# EAGLE design BIG deported Antenna (EAGLE 7.3.0)
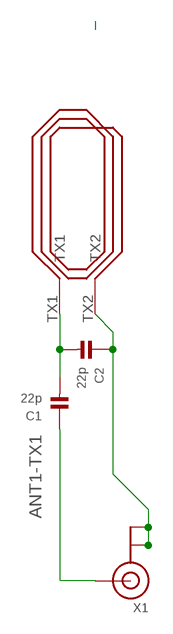
[diagram p0: schematic, sheet 1]

## Parts
C1  22p  CAP_CERAMIC0603  [0603]
C2  22p  CAP_CERAMIC0603  [0603]
U$1  KEYDUINO_DEPORTED_ANTENNA  [KEYDUINO_DEPORTED_ANTENNA]
X1  ANTENNA_U.FL  [U.FL]

## Nets
ANT1-TX1: C1.1 X1.3(SIGNAL)
N$1: C2.1 U$1.TX2 X1.1(GND) X1.2(GND)
TX2_ANTENNA: C1.2 C2.2 U$1.TX1

## Library data of the parts
C1 C2 = microbuilder:CAP_CERAMIC: Ceramic Capacitors 0402 - 0402 Surface Mount Capacitors 16pF 50V 5% [Digikey: 445-4899-2-ND] 18pF 50V 5% [Digikey: 490-1281-2-ND] 22pF 50V 5% [Digikey: 490-1283-2-ND] 68pF 50V 5% [Digikey: 490-1289-2-ND] 0.1uF 10V 10% [Digikey: 490-1318-2-ND] 0603 - 0603 Surface Mount Capacitors 16 pF 50V 5% [Digikey: 445-5051-2-ND] 22 pF 50V [Digikey: PCC220ACVTR-ND] 33 pF 50V 5% [Digikey: 490-1415-1-ND] 56pF 50V 5% [Digikey: 490-1421-1-ND] 220pF 50V 5% [Digikey: 445-1285-1-ND] 680 pF 50V 2200 pF 50V 5% C0G [Digikey: 445-1297-1-ND] 5600 pF 100V 5% X7R [Digikey: 478-3711-1-ND] 0.1 µF 25V 10% [Digikey: PCC2277TR-ND] 0.22 µF 16V 10% X7R [Digikey: 445-1318-1-ND] 1.0 µF 25V 10% [Digikey: 445-5146-2-ND] 0603 - RF Specific 3pF 250V +/-0.1pF RF [Digikey: 712-1347-1-ND] 18 pF 250V 5% [Digikey: 478-3505-1-ND or 712-1322-1-ND] 56 pF 250V 5% C0G RF [Digikey: 490-4867-1-ND] 68 pF 250V RF [Digikey: 490-4868-1-ND] 0805 - 0805 Surface Mount Capacitors 220 pF 250V 2% RF Ceramic Capacitor [Digikey: 712-1398-1-ND] 1000 pF 50V 2% NP0 Ceramic Capacitor [Digikey: 478-3760-1-ND] 0.1 µF 25V 10% Ceramic Capacitor [Digikey: PCC1828TR-ND] 1.0 µF 16V 10% Ceramic Capacitor[Digikey: 490-1691-2-ND] 10.0 µF 10V 10% Ceramic Capacitor[Digikey: 709-1228-1-ND] 47 uF 6.3V 20% Ceramic Capacitor [Digikey: 399-5506-1-ND] 1206 - 1206 Surface Mount Capacitors 47uF 10V 20% Ceramic Capacitor [Digikey: 399-5508-1-ND]
U$1 = KeyDuino:KEYDUINO_DEPORTED_ANTENNA
X1 = adafruit:ANTENNA_U.FL: U.FL Antenna Connector

## Net classes
0 default: width 0.203 mm
1 power: width 0.254 mm, drill 0.61 mm, clearance 0.254 mm
4 aref: width 0.254 mm, drill 0.61 mm, clearance 0.254 mm

## Board
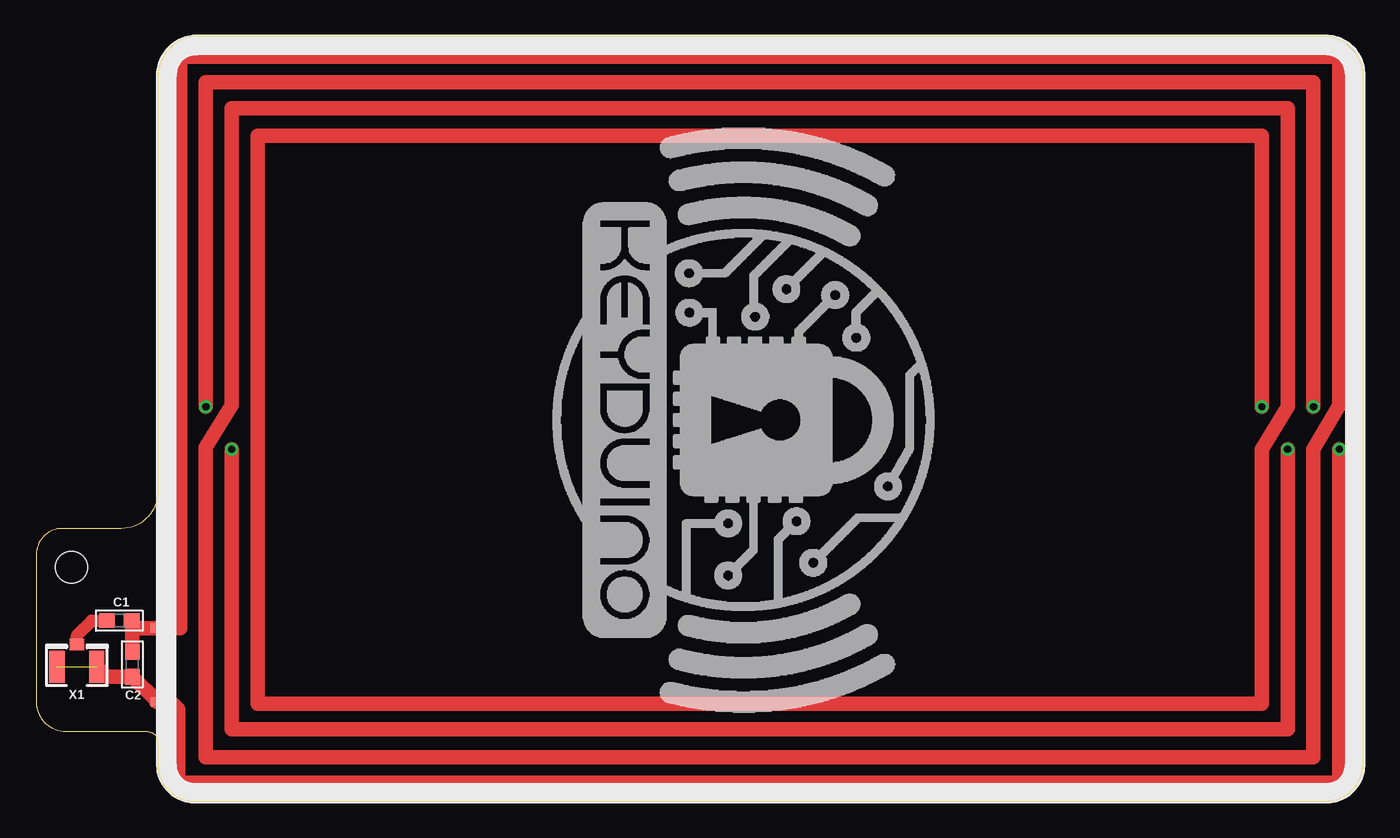
[diagram p1: board, top side]
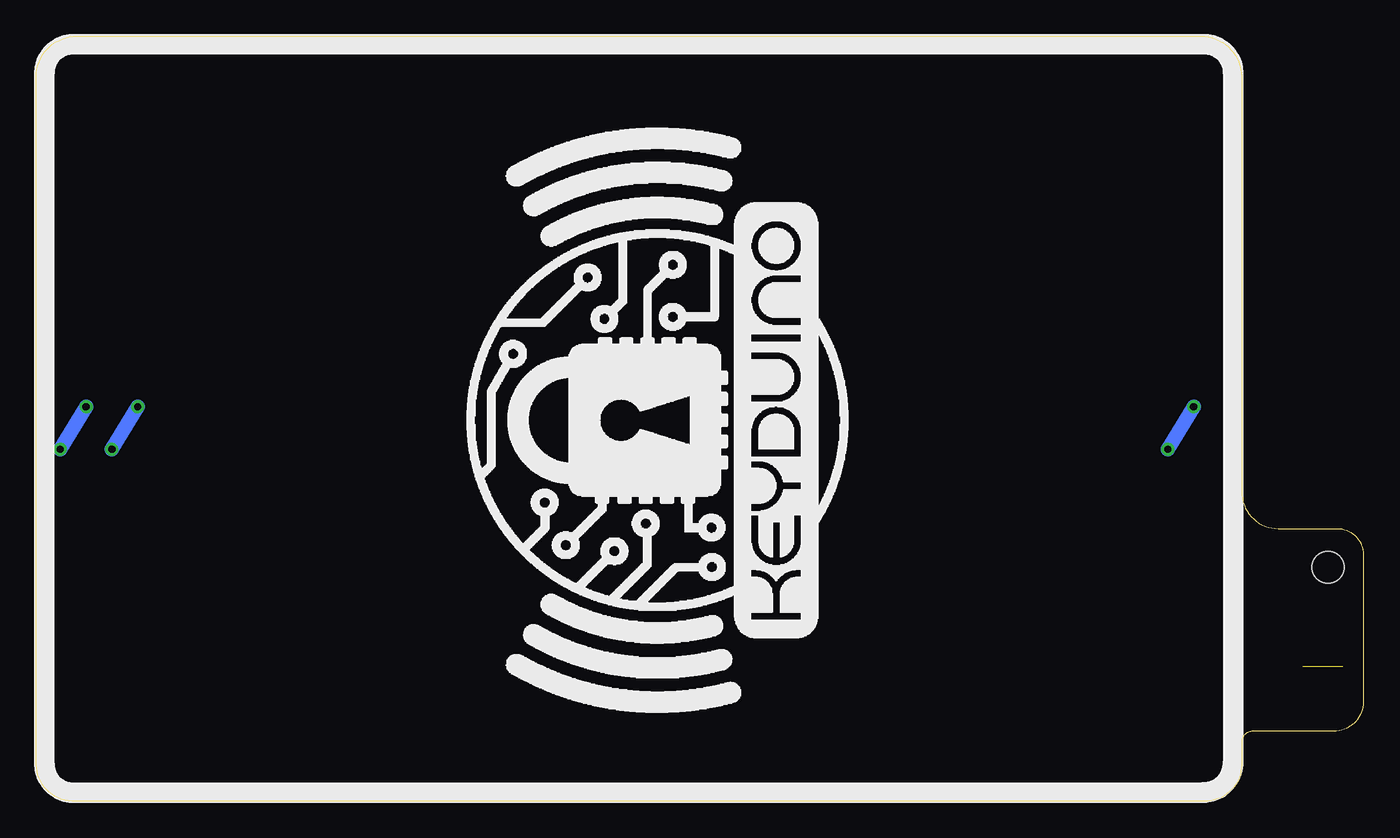
[diagram p2: board, bottom side, seen from below]

Size 91.44 x 52.7 mm. Coordinates in mm from the lower left corner, seen from the top.
Outline: 8.38,4.06 8.38,2.54 arc90 10.92,0 88.77,0 arc90 91.44,2.54 91.44,49.91 arc90 88.65,52.7 11.18,52.7 arc90 8.38,49.91 8.38,21.34 arc-90 5.84,18.8 1.78,18.8 arc90 0,17.02 0,6.86 arc90 2.03,4.83 7.62,4.83 arc-90 8.38,4.06
Copper layers (1*16): Top 0.035mm / dielectric 1.5mm / Bottom 0.035mm
Design rules "config1 *": minimum track width 0.125mm, minimum drill 0.3mm, track to track 0.125mm, track to pad 0.1mm, pad to pad 0.125mm, via to via 0.125mm, smd to smd 0mil, copper to edge 0.2mm, drill to drill 8mil, minimum pad ring 0.2mm, minimum via ring 0.1mm, stop-mask expansion 0.075mm, vias tented up to drill 0mil, thermal gap 0.2mm
Holes 2.2 mm at 2.41,16.13
tRestrict: area -0.8,-3.7 to 91.9,60.2
bRestrict: area -0.7,-4 to 92,59.9

### Footprints (pad centres in the part's own frame; a part is rotated, then mirrored left to right if it is on the bottom)
0603 = smd 1.1 x 1: 1 -0.85,0; 2 0.85,0
KEYDUINO_DEPORTED_ANTENNA = drill 0.5: P$1 -35.179,0.508; P$2 -33.401,-2.413; P$3 39.37,-2.413; P$4 37.592,0.508; P$5 41.148,0.508; P$6 42.926,-2.413 | smd 1.27 x 0.635: TX1 -38.354,-14.732; TX2 -38.354,-19.812
U.FL = smd 2.2 x 1.05: 1 0,1.375; 2 0,-1.375 | smd 0.8 x 1: 3 1.525,0

### Placement (x,y rotation side)
C1  5.72,12.45 0 top
C2  6.62,9.44 90 top
U$1  46.86,26.67 0 top
X1  2.79,9.27 90 top

### Tracks (layer width: path | path; a pad name or v marks a point on that pad's centre or on a via)
ANT1-TX1
  Top 0.813: X1.3 2.79,11.43 3.82,12.45 C1.1
N$1  (1 unrouted)
  Top 1.016: X1.2 4.85,8.59 C2.1 8.36,6.86 U$1.TX2
TX2_ANTENNA
  Top 1.016: C2.2 6.62,12.4 C1.2 arc90 7.09,11.94 U$1.TX1